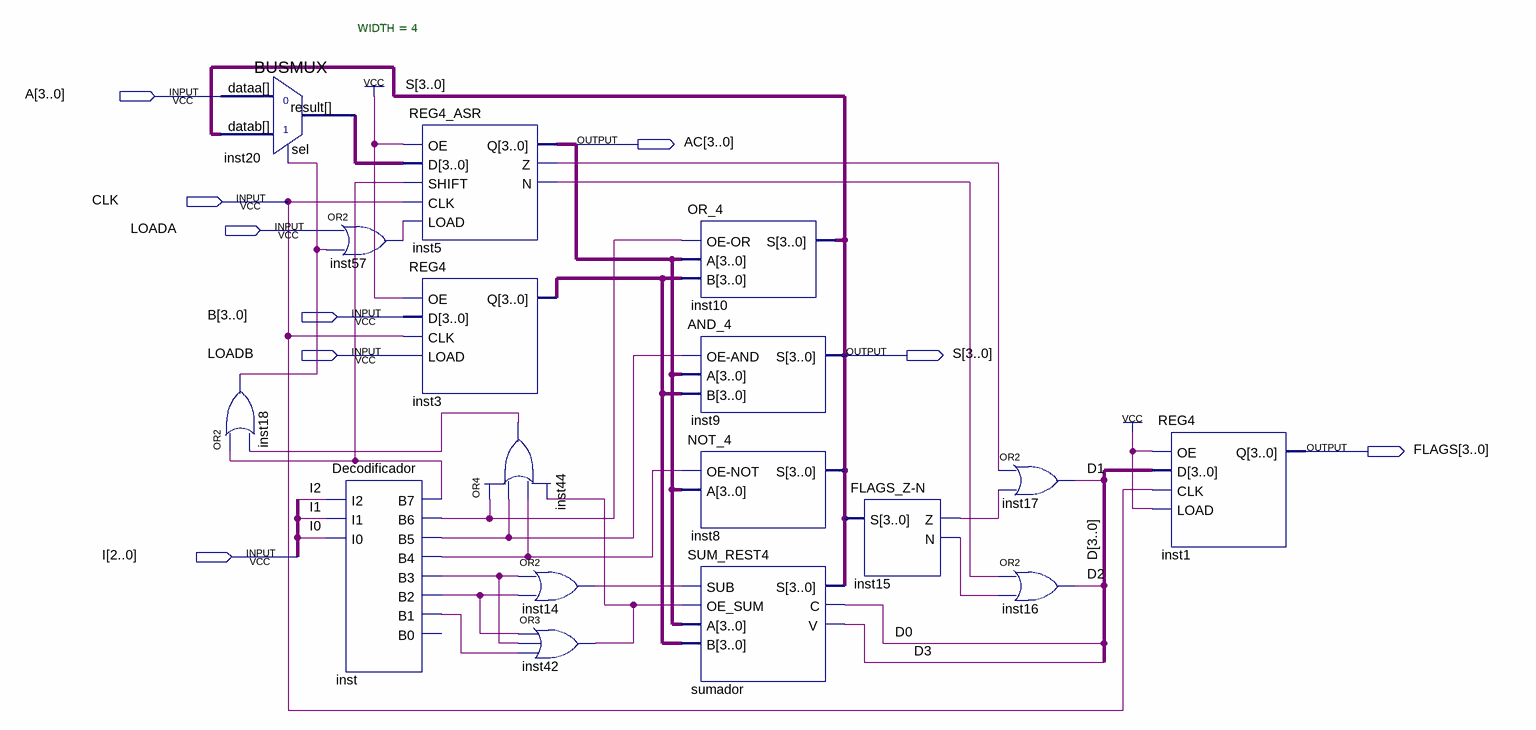
[diagram p0: schematic sheet]
// Quartus schematic MAIN.bdf as structural Verilog: 17 symbols, 9 pins
module MAIN (
  input  [3:0] A,
  input  CLK,
  input  LOADA,
  input  [3:0] B,
  input  LOADB,
  input  [2:0] I,
  output [3:0] AC,
  output [3:0] S,
  output [3:0] FLAGS
);

  wire inst5_n, inst5_z, inst14_out, inst15_n, inst15_z, inst18_out, inst42_out, inst44_out, inst57_out,
       inst_b1, inst_b2, inst_b3, inst_b4, inst_b5, inst_b6, inst_b7;
  wire [3:0] D, inst3_q, inst20_result;

  BUSMUX #(.WIDTH(4)) inst20 (.datab(S), .sel(inst18_out), .dataa(A), .result(inst20_result));
  or inst18 (inst18_out, inst_b7, inst44_out);
  or inst57 (inst57_out, LOADA, inst18_out);
  Decodificador inst (
    .I2(I[2]), .I1(I[1]), .I0(I[0]), .B7(inst_b7), .B1(inst_b1), .B3(inst_b3), .B5(inst_b5), .B2(inst_b2),
    .B4(inst_b4), .B6(inst_b6));  // open: B0
  REG4_ASR inst5 (
    .OE(1'b1), .D(inst20_result), .SHIFT(inst_b7), .CLK(CLK), .LOAD(inst57_out), .Q(AC), .Z(inst5_z),
    .N(inst5_n));
  REG4 inst3 (.OE(1'b1), .D(B), .CLK(CLK), .LOAD(LOADB), .Q(inst3_q));
  or inst44 (inst44_out, inst_b6, inst_b5, inst_b4, inst42_out);
  or inst14 (inst14_out, inst_b3, inst_b2);
  or inst42 (inst42_out, inst_b2, inst_b3, inst_b1);
  OR_4 inst10 (.\OE-OR (inst_b6), .A(AC), .B(inst3_q), .S(S));
  AND_4 inst9 (.\OE-AND (inst_b5), .A(AC), .B(inst3_q), .S(S));
  NOT_4 inst8 (.\OE-NOT (inst_b4), .A(AC), .S(S));
  SUM_REST4 sumador (.OE_SUM(inst42_out), .A(AC), .B(inst3_q), .SUB(inst14_out), .S(S), .C(D[0]), .V(D[3]));
  \FLAGS_Z-N  inst15 (.S(S), .N(inst15_n), .Z(inst15_z));
  or inst17 (D[1], inst5_z, inst15_z);
  or inst16 (D[2], inst5_n, inst15_n);
  REG4 inst1 (.OE(1'b1), .D(D), .CLK(CLK), .LOAD(1'b1), .Q(FLAGS));
endmodule
